# Altium schematic sheet Atmega328P_Shield.SchDoc
size A4; SheetNumber: 1; SheetTotal: 1
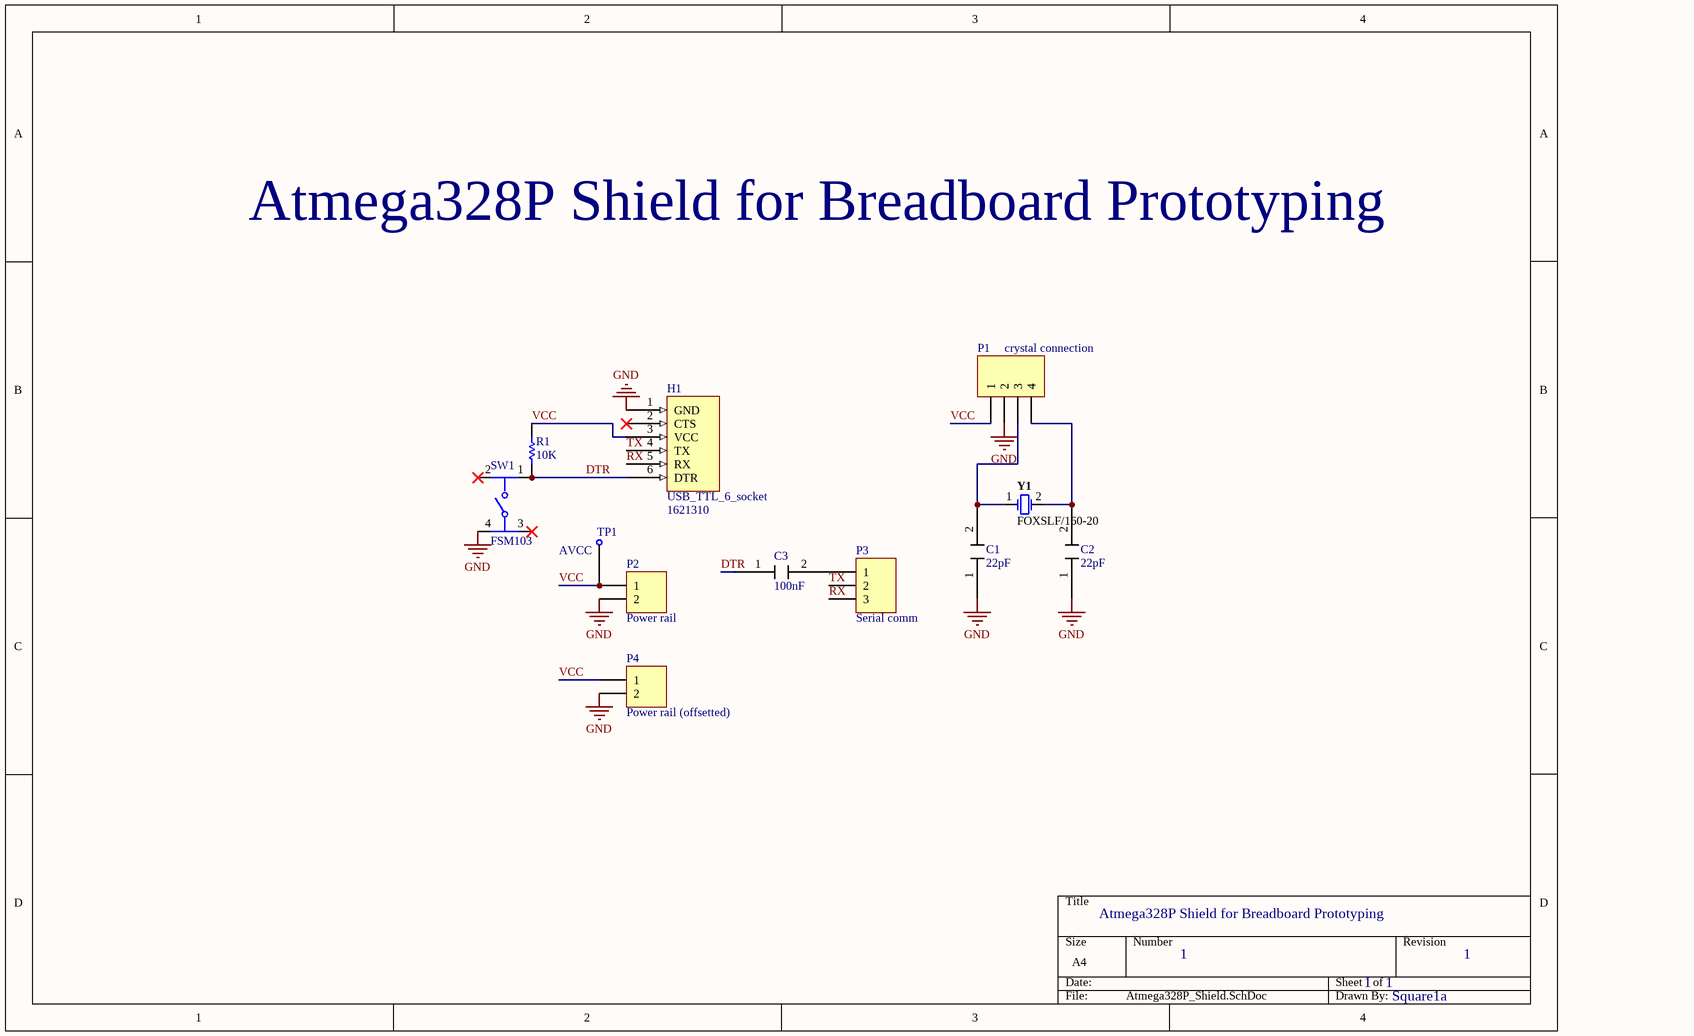
[diagram p0: Atmega328P_Shield.SchDoc]

## Parts
C1  22pF  [Ceramic Capacitor]
C2  22pF  [Ceramic Capacitor]
C3  100nF  [Ceramic Capacitor]
H1  USB_TTL_6_socket  Supplier Part Number 1: 1621310  [TTL USB (6 SOCKETS)]
P1  crystal connection  [HDR1X4]
P2  Power rail  [HDR1X2]
P3  Serial comm  [HDR1X3]
P4  Power rail (offsetted)  [HDR1X2]
R1  10K  [AXIAL-0.3]
SW1  FSM103  [FP-FSM103-MFG]
TP1  AVCC  [TEST_POINT]
Y1  FOXSLF/160-20  [FOX-FOXSLF160-20]

## Nets
GND: C1.1 C2.1 H1.1(GND) P1.2 P2.2 P4.2 SW1.4
DTR: C3.1 H1.6(DTR) R1.2 SW1.1
RX: H1.5(RX) P3.3
TX: H1.4(TX) P3.2
VCC: H1.3(VCC) P1.1 P2.1 P4.1 R1.1 TP1.1
NetC1_2: C1.2 P1.3 Y1.1
NetC2_2: C2.2 P1.4 Y1.2
NetC3_2: C3.2 P3.1

Not connected (* = marked no-connect by the designer): H1 2(CTS)*; SW1 2* 3*

## Notes on the sheet
- Atmega328P Shield for Breadboard Prototyping
- 1
- Square1a

## Library data of the parts
C1-C3 = capacitor
P1 = Header 4: Header, 4-Pin; LatestRevisionDate: 17-Jul-2002; LatestRevisionNote: Re-released for DXP Platform.; Publisher: Altium Limited
P2 P4 = Header 2: Header, 2-Pin; LatestRevisionDate: 17-Jul-2002; LatestRevisionNote: Re-released for DXP Platform.; Publisher: Altium Limited
P3 = Header 3: Header, 3-Pin; LatestRevisionDate: 17-Jul-2002; LatestRevisionNote: Re-released for DXP Platform.; Publisher: Altium Limited
R1 = Res1: Resistor; Published: 8-Jun-2000; LatestRevisionDate: 17-Jul-2002; LatestRevisionNote: Re-released for DXP Platform.; PackageReference: AXIAL-0.3; Publisher: Altium Limited; PackageDescription: Axial Device, Thru-Hole; 2 Leads; 0.3 in Pin Spacing
SW1 = CMP-03407-000037-1: SWITCH TACTILE SPST-NO 0.05A 24V; Contact Resistance: 100mR; Actuator Length: 3.4mm; Switch Function: Off-Mom; Operating Force: 1.57N; Illumination Type: Non-Illuminated; Voltage Rating (DC): 12V; Current Rating: 50mA; Actuator Material: Polyester; Switch Travel: 0.3mm; Throw Configuration: SPST; Actuator Color: Black; Mechanical Life: 100000Cycles; Depth: 14.1mm; RoHS Compliant: Yes; Max Operating Temperature: 85°C; Mount: Through Hole; Min Operating Temperature: -35°C; Contact Plating: Silver; Width: 12mm; Package Quantity: 400; Radiation Hardening: No; Series: FSM100 ~ 104; Type: Switch; Termination: PC Pins; Voltage Rating: 24V; Contact Material: Brass; Max Voltage Rating (DC): 12V; Contact Current Rating: 50mA; Length: 12mm; Packaging: Loose Piece; Orientation: Straight; Max Current Rating: 50mA; Electrical Life: 100000Cycles
TP1 = Testpoint: Polyurethane Multi-Purpose Cream Adhesive, 10.3 oz Cartridge; Manufacturer: Keystone Electronics; Manufacturer Part Number: 5010; Body Material: Bronze,PBT; Plating: Silver; Number of Ports: 1; Inside Diameter: 1.78mm; Hole Diameter: 1.6mm; Supplier 1: Digi-Key; RoHS: Yes; Category: Connectors; Stock 1: 546313; Pricing 1: 1=0.42000, 25=0.34080, 100=0.30150, 250=0.28304, 500=0.25230, 1000=0.19884, 2500=0.18180, 5000=0.17044 (USD); Mount: Through Hole,PCB; Contact Material: Bronze; Contact Plating: Silver,Tin; Color: Red; Material: Nylon,Bronze,Silver; Housing Color: Red; Insulation Material: Nylon; Packaging: Bulk; Series: THM; Package Quantity: 100; Termination: Through Hole; Orientation: Straight; Length: 11.3mm; Height: 0.445inch; Lead Free: Lead Free; Flammability Rating: UL94 V-0; RoHS Compliant: Yes; REACH SVHC: No SVHC; ComponentLink1URL: https://datasheet.ciiva.com/11744/0900766b8009b7c7-11744920.pdf?src-supplier=RSComponents; ComponentLink1Description: https://datasheet.ciiva.com/11744/0900766b8009b7c7-11744920.pdf?src-supplier=RSComponents; ComponentLink2URL: https://datasheet.ciiva.com/16506/m60-2p60-16506972.pdf?src-supplier=Future+Electronics; ComponentLink2Description: https://datasheet.ciiva.com/16506/m60-2p60-16506972.pdf?src-supplier=Future+Electronics; ComponentLink3URL: https://datasheet.ciiva.com/16883/70182825-16883886.pdf?src-supplier=Allied+Electronics; ComponentLink3Description: https://datasheet.ciiva.com/16883/70182825-16883886.pdf?src-supplier=Allied+Electronics; ComponentLink4URL: https://datasheet.ciiva.com/1454/1703983-1454833.pdf?src-supplier=Element14; ComponentLink4Description: https://datasheet.ciiva.com/1454/1703983-1454833.pdf?src-supplier=Element14; ComponentLink5URL: https://datasheet.ciiva.com/22631/1703983-22631113.pdf?src-supplier=Element14; ComponentLink5Description: https://datasheet.ciiva.com/22631/1703983-22631113.pdf?src-supplier=Element14; ComponentLink6URL: https://datasheet.ciiva.com/2917/5010-2917626.pdf?src-supplier=Digi-Key; ComponentLink6Description: https://datasheet.ciiva.com/2917/5010-2917626.pdf?src-supplier=Digi-Key; Supplier Part Number 1: 36-5010-ND
Y1 = CMP-1749-00003-1: Resistance Weld Thru-Hole Crystal, 16 MHz, -20 to 70 degC, 2-Pin THD, RoHS, Bulk; Voltage Rating: 250 V; Tolerance: 1%; Resistance: 221 kohm; Case\Package: Axial; Power Rating: 250 mW; RoHSCompliant: true; Package Quantity: 200; Packaging: Bulk; Min Operating Temperature: -55 degC; DatasheetVersion: Mar-15; ComponentLink1URL: http://www.foxonline.com/; Max Operating Temperature: 155 degC; PackageReference: FOXSLF160-20; Mount: Through Hole; PackageDescription: 2-Pin Through Hole Device, Body 11.35 x 4.65 mm; ComponentLink1Description: Manufacturer URL; ComponentLink2URL: http://www.foxonline.com/pdfs/hc49slf.pdf; ComponentLink2Description: Datasheet; Length: 0.248 inch
H1 = USB_TTL_6_socket: Supplier 1: Rs